# Altium project CONNECTORS.PrjPcb
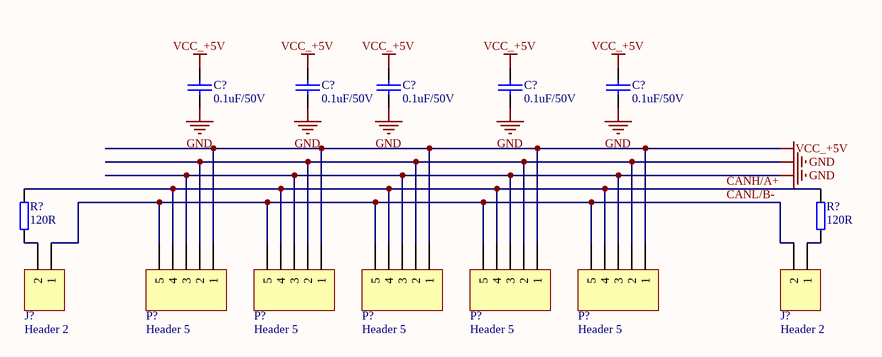
[diagram p0: Sheet1.SchDoc]
1 sheet, 14 parts. Net scope: global (net labels, ports and power ports of the same name join across sheets).
Board file: CONNECTORS.PcbDoc

## Sheet Sheet1.SchDoc
size A4

### Parts
C1  0.1uF/50V  [0603C]
C2  0.1uF/50V  [0603C]
C3  0.1uF/50V  [0603C]
C4  0.1uF/50V  [0603C]
C5  0.1uF/50V  [0603C]
J1  Header 2  [HDR1*2]
J2  Header 2  [HDR1*2]
P1  Header 5  [XH2.54-5P]
P2  Header 5  [XH2.54-5P]
P3  Header 5  [XH2.54-5P]
P4  Header 5  [XH2.54-5P]
P5  Header 5  [XH2.54-5P]
R1  120R  [0603R]
R2  120R  [0603R]

### Nets
GND: C1.1 C2.1 C3.1 C4.1 C5.1 P1.2 P1.3 P2.2 P2.3 P3.2 P3.3 P4.2 P4.3 P5.2 P5.3
VCC_+5V: C1.2 C2.2 C3.2 C4.2 C5.2 P1.1 P2.1 P3.1 P4.1 P5.1
CANH/A+: P1.4 P2.4 P3.4 P4.4 P5.4 R1.2 R2.2
CANL/B-: J1.1 J2.2 P1.5 P2.5 P3.5 P4.5 P5.5
NetJ1_2: J1.2 R1.1
NetJ2_1: J2.1 R2.1

### Library data of the parts
C1-C5 = CAP: Capacitor
J1 J2 = Header 2: Header, 2-Pin; LatestRevisionDate: 17-Jul-2002; LatestRevisionNote: Re-released for DXP Platform.; Publisher: Altium Limited
P1-P5 = Header 5: Header, 5-Pin; LatestRevisionDate: 17-Jul-2002; LatestRevisionNote: Re-released for DXP Platform.; Publisher: Altium Limited
R1 R2 = RES2A